# EAGLE design REDOUBLER (EAGLE 7.2.0)
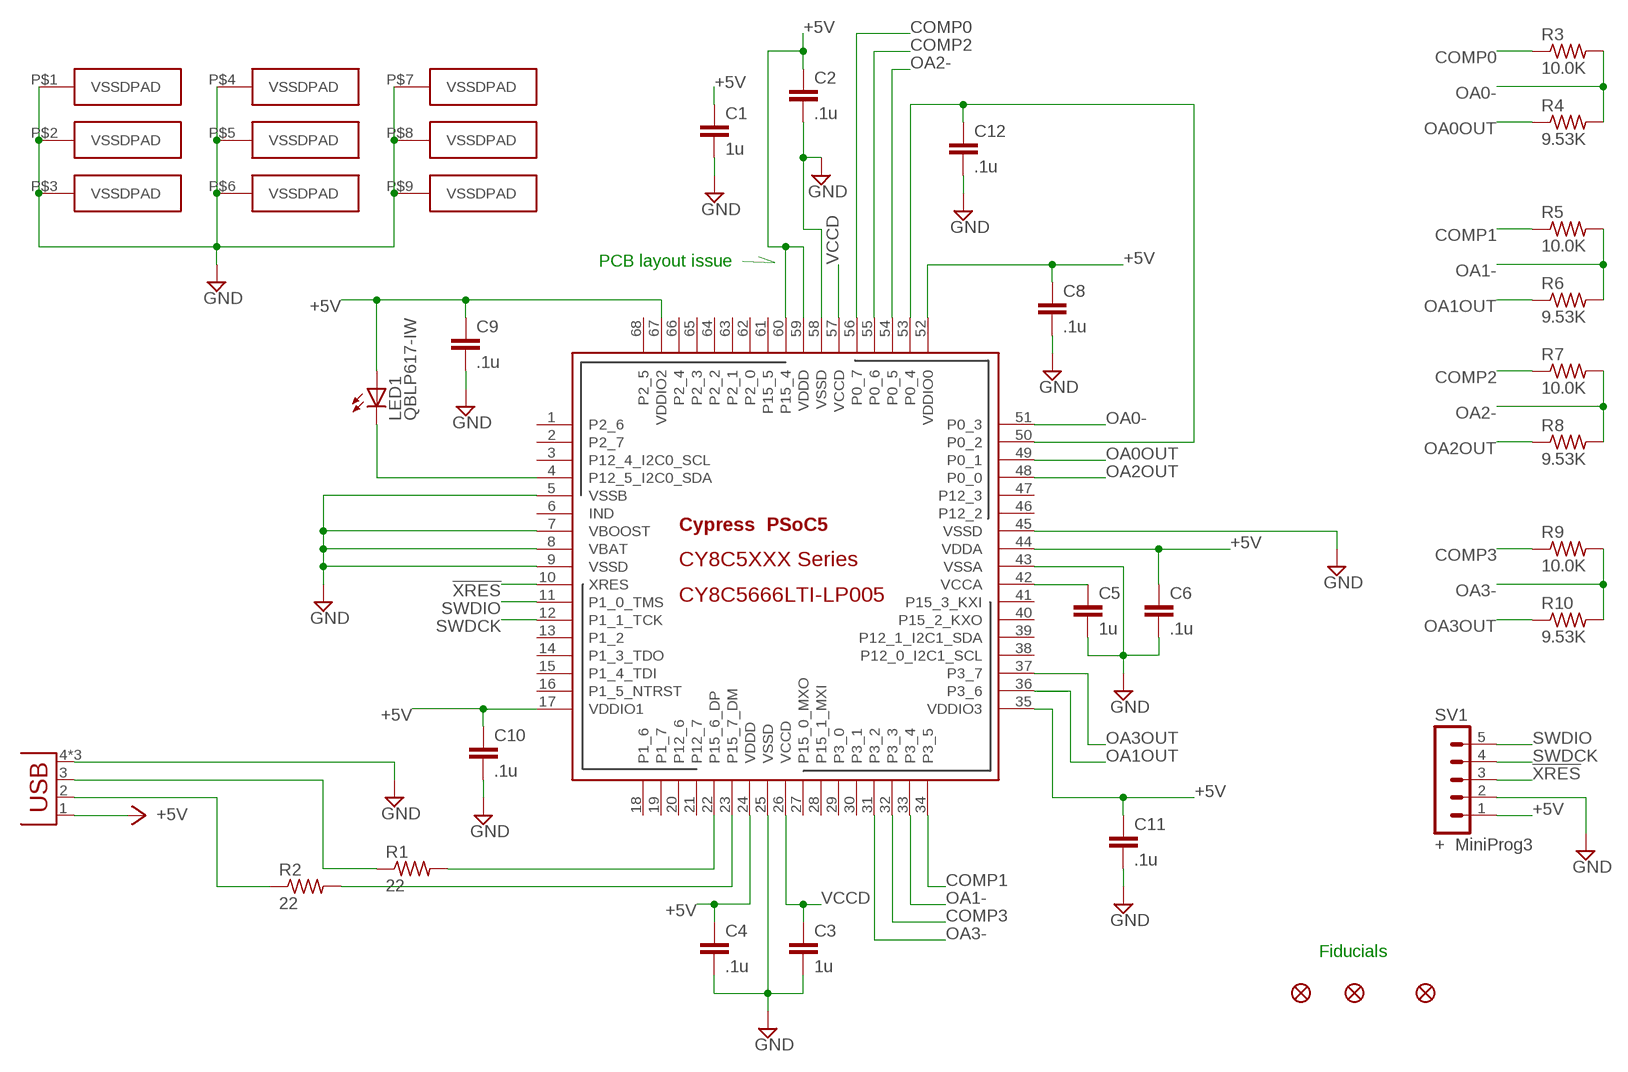
[diagram p0: schematic, sheet 1]

## Parts
C1  1u  C-EUC0402  [C0402]
C2  .1u  C-EUC0402  [C0402]
C3  1u  C-EUC0402  [C0402]
C4  .1u  C-EUC0402  [C0402]
C5  1u  C-EUC0402  [C0402]
C6  .1u  C-EUC0402  [C0402]
C8  .1u  C-EUC0402  [C0402]
C9  .1u  C-EUC0402  [C0402]
C10  .1u  C-EUC0402  [C0402]
C11  .1u  C-EUC0402  [C0402]
C12  .1u  C-EUC0402  [C0402]
FID1  FIDUCIALUFIDUCIAL  [MICRO-FIDUCIAL]
FID2  FIDUCIALUFIDUCIAL  [MICRO-FIDUCIAL]
FID3  FIDUCIALUFIDUCIAL  [MICRO-FIDUCIAL]
LED1  QBLP617-IW  LEDCHIP-LED0603  [CHIP-LED0603]
R1  22  R-US_R0402  [R0402]
R2  22  R-US_R0402  [R0402]
R3  10.0K  R-US_R0402  [R0402]
R4  9.53K  R-US_R0402  [R0402]
R5  10.0K  R-US_R0402  [R0402]
R6  9.53K  R-US_R0402  [R0402]
R7  10.0K  R-US_R0402  [R0402]
R8  9.53K  R-US_R0402  [R0402]
R9  10.0K  R-US_R0402  [R0402]
R10  9.53K  R-US_R0402  [R0402]
SV1  + MiniProg3  MA05-1  [MA05-1]
U$1  CY8C5666LTI-LP005  CY8C5XXX-68PIN  [QFN68]
X1  USBSMT-MALE  [USB-A-SMT-MALE]

## Nets
!XRES!: SV1.3 U$1.10(XRES)
+5V: C1.1 C2.1 C4.1 C6.1 C8.1 C9.1 C10.1 C11.1 LED1.A SV1.1 U$1.17(VDDIO1) U$1.24(VDDD) U$1.35(VDDIO3) U$1.44(VDDA) U$1.52(VDDIO0) U$1.59(VDDD) U$1.60(P15_4) U$1.67(VDDIO2) X1.1(VCC)
COMP0: R3.1 U$1.56(P0_7)
COMP1: R5.1 U$1.34(P3_5)
COMP2: R7.1 U$1.55(P0_6)
COMP3: R9.1 U$1.32(P3_3)
GND: C1.2 C2.2 C3.2 C4.2 C5.2 C6.2 C8.2 C9.2 C10.2 C11.2 C12.2 SV1.2 U$1.5(VSSB) U$1.7(VBOOST) U$1.8(VBAT) U$1.9(VSSD) U$1.25(VSSD) U$1.43(VSSA) U$1.45(VSSD) U$1.58(VSSD) U$1.P$1(VSSDPAD) U$1.P$2(VSSDPAD) U$1.P$3(VSSDPAD) U$1.P$4(VSSDPAD) U$1.P$5(VSSDPAD) U$1.P$6(VSSDPAD) U$1.P$7(VSSDPAD) U$1.P$8(VSSDPAD) U$1.P$9(VSSDPAD) X1.4(GND) X1.P$1(GND) X1.P$3(GND)
N$1: C12.1 U$1.50(P0_2) U$1.53(P0_4)
N$3: LED1.C U$1.4(P12_5_I2C0_SDA)
N$5: R1.1 X1.3(D+)
N$6: R2.1 X1.2(D-)
N$7: R1.2 U$1.22(P15_6_DP)
N$8: R2.2 U$1.23(P15_7_DM)
N$10: C5.1 U$1.42(VCCA)
OA0-: R3.2 R4.2 U$1.51(P0_3)
OA0OUT: R4.1 U$1.49(P0_1)
OA1-: R5.2 R6.2 U$1.33(P3_4)
OA1OUT: R6.1 U$1.36(P3_6)
OA2-: R7.2 R8.2 U$1.54(P0_5)
OA2OUT: R8.1 U$1.48(P0_0)
OA3-: R9.2 R10.2 U$1.31(P3_2)
OA3OUT: R10.1 U$1.37(P3_7)
SWDCK: SV1.4 U$1.12(P1_1_TCK)
SWDIO: SV1.5 U$1.11(P1_0_TMS)
VCCD: C3.1 U$1.26(VCCD) U$1.57(VCCD)
Unconnected: U$1.1(P2_6) U$1.2(P2_7) U$1.3(P12_4_I2C0_SCL) U$1.6(IND) U$1.13(P1_2) U$1.14(P1_3_TDO) U$1.15(P1_4_TDI) U$1.16(P1_5_NTRST) U$1.18(P1_6) U$1.19(P1_7) U$1.20(P12_6) U$1.21(P12_7) U$1.27(P15_0_MXO) U$1.28(P15_1_MXI) U$1.29(P3_0) U$1.30(P3_1) U$1.38(P12_0_I2C1_SCL) U$1.39(P12_1_I2C1_SDA) U$1.40(P15_2_KXO) U$1.41(P15_3_KXI) U$1.46(P12_2) U$1.47(P12_3) U$1.61(P15_5) U$1.62(P2_0) U$1.63(P2_1) U$1.64(P2_2) U$1.65(P2_3) U$1.66(P2_4) U$1.68(P2_5)

## Notes on the sheet
- PCB layout issue
- Fiducials

## Library data of the parts
C1-C6 C8-C12 = rcl:C-EU: CAPACITOR, European symbol
FID1-FID3 = SparkFun-Aesthetics:FIDUCIAL: Fiducial Alignment Points Various fiducial points for machine vision alignment.
LED1 = adafruit:LED: LED OSRAM: - CHIPLED LG R971, LG N971, LY N971, LG Q971, LY Q971, LO R971, LY R971 LH N974, LH R974 LS Q976, LO Q976, LY Q976 LO Q996 - Hyper CHIPLED LW Q18S LB Q993, LB Q99A, LB R99A - SideLED LS A670, LO A670, LY A670, LG A670, LP A670 LB A673, LV A673, LT A673, LW A673 LH A674 LY A675 LS A676, LA A676, LO A676, LY A676, LW A676 LS A679, LY A679, LG A679 - Hyper Micro SIDELED® LS Y876, LA Y876, LO Y876, LY Y876 LT Y87S - SmartLED LW L88C, LW L88S LB L89C, LB L89S, LG L890 LS L89K, LO L89K, LY L89K LS L896, LA L896, LO L896, LY L896 - TOPLED LS T670, LO T670, LY T670, LG T670, LP T670 LSG T670, LSP T670, LSY T670, LOP T670, LYG T670 LG T671, LOG T671, LSG T671 LB T673, LV T673, LT T673, LW T673 LH T674 LS T676, LA T676, LO T676, LY T676, LB T676, LH T676, LSB T676, LW T676 LB T67C, LV T67C, LT T67C, LS T67K, LO T67K, LY T67K, LW E67C LS E67B, LA E67B, LO E67B, LY E67B, LB E67C, LV E67C, LT E67C LW T67C LS T679, LY T679, LG T679 LS T770, LO T770, LY T770, LG T770, LP T770 LB T773, LV T773, LT T773, LW T773 LH T774 LS E675, LA E675, LY E675, LS T675 LS T776, LA T776, LO T776, LY T776, LB T776 LHGB T686 LT T68C, LB T68C - Hyper Mini TOPLED® LB M676 - Mini TOPLED Santana® LG M470 LS M47K, LO M47K, LY M47K Source: http://www.osram.convergy.de/
R1-R10 = adafruit:R-US_: RESISTOR, American symbol
SV1 = con-lstb:MA05-1: PIN HEADER; OC_FARNELL: unknown; OC_NEWARK: unknown
U$1 = PatternAgents-Cypress:CY8C5XXX-68PIN: Cypress PSoC® 5 - Programmable System on Chip, ARM Cortex-M3 Based Source Data: http://www.cypress.com/?mpn=CY8C5868LTI-LP038 PKG Source: http://www.cypress.com/?docID=38892 LBR Source: http://www.patternagents.com THIS SOFTWARE IS PROVIDED BY THE CONTRIBUTORS "AS IS" AND WITHOUT ANY EXPRESS OR IMPLIED WARRANTIES, INCLUDING, BUT NOT LIMITED TO, THE IMPLIED WARRANTIES OF MERCHANTABILITY AND FITNESS FOR A PARTICULAR PURPOSE ARE DISCLAIMED. IN NO EVENT SHALL THE COPYRIGHT OWNER OR CONTRIBUTORS BE LIABLE FOR ANY DIRECT, INDIRECT, INCIDENTAL, SPECIAL, EXEMPLARY, OR CONSEQUENTIAL DAMAGES (INCLUDING, BUT NOT LIMITED TO, PROCUREMENT OF SUBSTITUTE GOODS OR SERVICES; LOSS OF USE, DATA, OR PROFITS; OR BUSINESS INTERRUPTION) HOWEVER CAUSED AND ON ANY THEORY OF LIABILITY, WHETHER IN CONTRACT, STRICT LIABILITY, OR TORT (INCLUDING NEGLIGENCE OR OTHERWISE) ARISING IN ANY WAY OUT OF THE USE OF THIS SOFTWARE, EVEN IF ADVISED OF THE POSSIBILITY OF SUCH DAMAGE.
X1 = infnoise:USB: USB Connectors

## Board
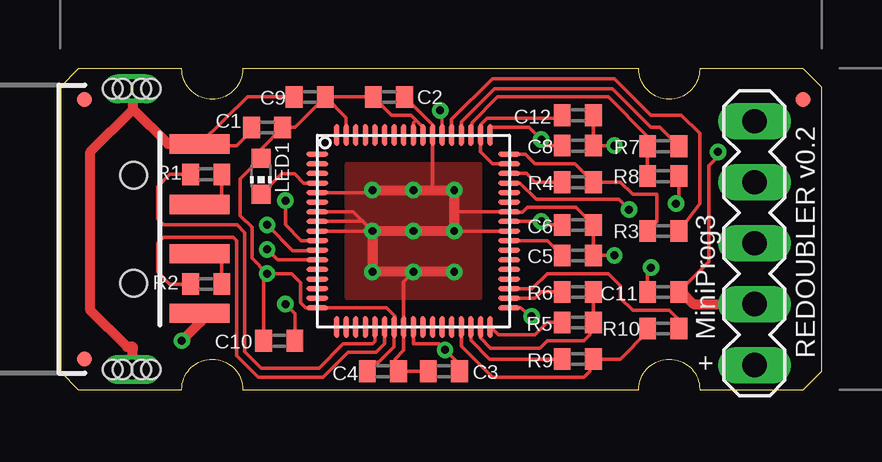
[diagram p1: board, top side]
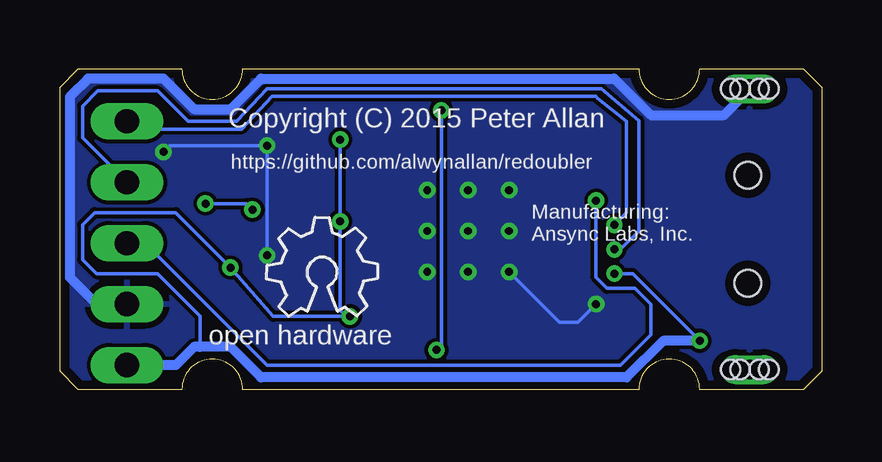
[diagram p2: board, bottom side, seen from below]

Size 31.75 x 13.36 mm. Coordinates in mm from the lower left corner, seen from the top.
Outline: 31.75,0.76 31.75,12.6 30.99,13.36 26.67,13.36 arc-90 25.4,12.09 arc-90 24.13,13.36 7.62,13.36 arc-90 6.35,12.09 arc-90 5.08,13.36 0.76,13.36 0,12.6 0,0.76 0.76,0 5.08,0 arc-90 6.35,1.27 arc-90 7.62,0 24.13,0 arc-90 25.4,1.27 arc-90 26.67,0 30.99,0 31.75,0.76
Copper layers (1*16): Top 0.0356mm / dielectric 1.5011mm / Bottom 0.0356mm
Design rules "LaenPCBOrder *": minimum track width 6mil, minimum drill 13mil, track to track 6mil, track to pad 6mil, pad to pad 6mil, via to via 6mil, smd to smd 6mil, copper to edge 15mil, drill to drill 6mil, minimum pad ring 7mil, minimum via ring 7mil, stop-mask expansion 3mil, vias tented up to drill 13mil, thermal gap 10mil
tKeepout: area 29.7,0 to 31.8,2; area 29.7,11.3 to 31.8,13.4; area 23.7,-1.7 to 27.1,1.7; area 4.6,-1.7 to 8.1,1.7; area 4.6,11.6 to 8.1,15.1; area 23.7,11.6 to 27.1,15.1

### Footprints (pad centres in the part's own frame; a part is rotated, then mirrored left to right if it is on the bottom)
C0402 = smd 0.7 x 0.9: 1 -0.65,0; 2 0.65,0
MICRO-FIDUCIAL = smd 0.635 x 0.635: 1 0,0
CHIP-LED0603 = smd 0.8 x 0.8: A 0,-0.75; C 0,0.75
R0402 = smd 0.7 x 0.9: 1 -0.65,0; 2 0.65,0
MA05-1 = drill 1.016 long: 1 -5.08,0; 2 -2.54,0; 3 0,0; 4 2.54,0; 5 5.08,0
QFN68 = smd 0.9 x 0.2: 1 -4,3.2; 2 -4,2.8; 3 -4,2.4; 4 -4,2; 5 -4,1.6; 6 -4,1.2; 7 -4,0.8; 8 -4,0.4; 9 -4,0; 10 -4,-0.4; 11 -4,-0.8; 12 -4,-1.2; 13 -4,-1.6; 14 -4,-2; 15 -4,-2.4; 16 -4,-2.8; 17 -4,-3.2; 35 4,-3.2; 36 4,-2.8; 37 4,-2.4; 38 4,-2; 39 4,-1.6; 40 4,-1.2; 41 4,-0.8; 42 4,-0.4; 43 4,0; 44 4,0.4; 45 4,0.8; 46 4,1.2; 47 4,1.6; 48 4,2; 49 4,2.4; 50 4,2.8; 51 4,3.2 | smd 0.2 x 0.9: 18 -3.2,-4; 19 -2.8,-4; 20 -2.4,-4; 21 -2,-4; 22 -1.6,-4; 23 -1.2,-4; 24 -0.8,-4; 25 -0.4,-4; 26 0,-4; 27 0.4,-4; 28 0.8,-4; 29 1.2,-4; 30 1.6,-4; 31 2,-4; 32 2.4,-4; 33 2.8,-4; 34 3.2,-4; 52 3.2,4; 53 2.8,4; 54 2.4,4; 55 2,4; 56 1.6,4; 57 1.2,4; 58 0.8,4; 59 0.4,4; 60 0,4; 61 -0.4,4; 62 -0.8,4; 63 -1.2,4; 64 -1.6,4; 65 -2,4; 66 -2.4,4; 67 -2.8,4; 68 -3.2,4 | drill 0.33: P$1 -1.705,-1.705; P$2 0,-1.705; P$3 1.705,-1.705; P$4 1.705,0; P$5 0,0; P$6 -1.705,0; P$7 -1.705,1.705; P$8 0,1.705; P$9 1.705,1.705
USB-A-SMT-MALE = smd 0.8 x 2.5: 1 -3.5,-5.87; 2 -1.027,-5.87; 3 1.027,-5.87; 4 3.551,-5.87 | drill 0.8 pad 0.94 long: P$1 5.85,-3.05; P$3 -5.85,-3.05 | hole 1.1: 2.25,-3.12; -2.25,-3.12 | hole 0.8: -5.85,-3.45; -5.85,-3.85; -5.85,-2.65; -5.85,-2.25; 5.85,-3.45; 5.85,-3.85; 5.85,-2.65; 5.85,-2.25

### Placement (x,y rotation side)
C1  8.64,10.92 180 top
C2  13.72,12.19 0 top
C3  16,0.76 180 top
C4  13.46,0.76 0 top
C5  21.59,5.59 0 top
C6  21.59,6.86 0 top
C8  21.59,10.16 0 top
C9  10.41,12.19 180 top
C10  9.14,2.03 0 top
C11  25.15,4.06 0 top
C12  21.59,11.43 0 top
FID1  1.02,1.27 0 top
FID2  1.02,12.09 0 top
FID3  30.99,12.09 0 top
LED1  8.38,8.89 180 top
R1  6.1,8.97 180 top
R2  6.1,4.39 180 top
R3  25.15,6.6 180 top
R4  21.59,8.64 0 top
R5  21.59,2.79 0 top
R6  21.59,4.06 0 top
R7  25.15,10.13 180 top
R8  25.15,8.89 180 top
R9  21.59,1.27 0 top
R10  25.15,2.54 180 top
SV1  28.96,6.1 90 top
U$1  14.73,6.6 0 top
X1  -0.05,6.68 90 top

### Tracks (layer width: path | path; a pad name or v marks a point on that pad's centre or on a via)
!XRES!  (via drill 0.33)
  Top 0.152: U$1.10 10.05,6.2 9.4,6.86 v9.4,7.87
  Bottom 0.152: SV1.3 28.19,6.1 23.11,1.02 8.38,1.02 7.11,2.29 7.11,3.56 7.77,4.22 8.94,4.22 9.4,4.67 v9.4,7.87
+5V  (via drill 0.33)
  Top 0.152: C4.1 13.19,1.14 13.28,1.14 13.93,1.79 U$1.24 13.97,2.64 13.97,3.05 13.61,3.4 U$1.17 10.24,3.4 10.03,3.61 10.03,4.45 9.65,4.83 v8.64,4.83 | U$1.44 v20.07,7.01 20.22,6.86 C6.1 | U$1.35 19.2,3.4 v19.66,3.05 | U$1.67 11.93,11.32 C9.1 | C9.1 C2.1 13.83,11.43 14.63,11.43 14.83,11.23 | C8.1 20.32,10.16 v20.07,10.41 19.56,10.92 18.03,10.92 17.93,10.82 U$1.52 | U$1.59 15.13,10.93 14.83,11.23 | U$1.60 14.73,11.12 14.83,11.23 | C11.1 24.5,4.94 v24.64,5.08 | C9.1 9.79,10.92 C1.1 8.38,10.02 LED1.A 7.52,8.78 7.52,7.24 8,6.76 8,5.46 v8.64,4.83 | C10.1 8.49,4.68 v8.64,4.83
  Top 0.406: X1.1 5.87,2.82 v5.08,2.03
  Bottom 0.152: 25.91,1.78 25.91,3.05 27.69,4.83 30.23,4.83 30.81,5.41 30.81,6.86 30.3,7.37 26.92,7.37 v24.64,5.08 22.86,3.05 v19.66,3.05 19.81,3.05 20.07,3.3 v20.07,7.01 v20.07,10.41 | v5.08,2.03 7.87,4.83 v8.64,4.83
  Bottom 0.406: v5.08,2.03 6.6,2.03 8.13,0.51 23.37,0.51 24.64,1.78 25.91,1.78 26.16,1.78 26.92,1.02 SV1.1
COMP0
  Top 0.152: U$1.56 16.33,11.25 18.03,12.95 23.11,12.95 24.64,11.43 25.91,11.43 26.67,10.67 26.67,7.73 R3.1
COMP1
  Top 0.152: U$1.34 17.97,2.6 18.29,2.29 19.81,2.29 20.32,2.79 R5.1
COMP2
  Top 0.152: U$1.55 16.74,10.61 16.74,11.15 18.11,12.52 23.04,12.52 24.64,10.92 25.01,10.92 R7.1
COMP3
  Top 0.152: U$1.32 17.13,2.04 17.91,1.27 R9.1
GND  (via drill 0.33)  (1 unrouted)
  Top 0.152: C3.2 C4.2 13.97,0.9 13.97,1.27 14.33,1.63 U$1.25 14.33,4.5 U$1.P$2 | 15.49,8.31 15.53,8.35 U$1.58 15.53,11.04 15.49,11.07 15.48,11.07 C2.2 | U$1.43 U$1.P$4 | 16.44,7.37 16.48,7.4 U$1.45 18.75,7.39 19.28,7.39 19.48,7.59 21.5,7.59 C6.2 C5.2 v23.11,5.59 | 25.91,4.06 C11.2 27.05,5.32 27.05,9.32 27.43,9.7 v27.43,9.91 | U$1.5 12.92,8.2 U$1.P$7 | U$1.9 U$1.P$6 | U$1.8 12.63,7 U$1.P$6 | U$1.7 12.23,7.4 U$1.P$6 | C9.2 7.83,12.19 X1.4 5.94,10.16 7.37,10.16 7.99,10.78 C1.2 | v23.11,10.16 C8.2 C12.2 | C10.2 9.79,3.16 v9.4,3.56
  Top 0.406: 3.05,11.68 3.05,12.53 X1.P$1 | X1.P$3 3.05,1.78 2.8,1.78 1.27,3.3 1.27,9.91 3.05,11.68 | U$1.P$7 U$1.P$8 15.49,8.31 U$1.P$9 16.44,7.37 U$1.P$4 U$1.P$5 U$1.P$6 U$1.P$1 U$1.P$2 U$1.P$3 | 25.91,4.06 26.42,3.56 SV1.2 | X1.4 4.5,10.23 3.05,11.68
  Bottom 0.152: v27.43,9.91 27.18,10.16 v23.11,10.16 v23.11,5.59 | U$1.P$1 10.92,2.79 10.16,2.79 v9.4,3.56
  Bottom 0.406: 3.05,12.45 4.06,11.43 7.11,11.43 8.64,12.95 23.37,12.95 24.64,11.68 26.16,11.68 27.43,12.95 30.58,12.95 31.34,12.19 31.34,4.67 30.23,3.56 SV1.2
  pour Top: 11.94,9.4 17.53,9.4 17.53,3.81 11.94,3.81
  pour Bottom: 0,13.46 31.75,13.46 31.75,0 0,0
N$1
  Top 0.152: U$1.50 18.03,9.4 17.53,9.91 U$1.53 17.56,11.05 17.8,11.3 20.81,11.3 C12.1
N$3
  Top 0.152: LED1.C 9.23,8.99 9.78,8.99 10.17,8.6 U$1.4
N$5
  Top 0.152: R1.1 6.75,8.02 6.6,7.87 6.04,7.87 X1.3
N$6
  Top 0.152: R2.1 6.75,5.45 6.6,5.59 5.93,5.59 X1.2
N$7
  Top 0.152: U$1.22 | R1.2 4.57,8.97 4.06,8.46 4.06,7.11 4.32,6.86 7.39,6.86 7.7,6.53 7.7,1.57 8.38,0.89 10.79,0.89 11.81,1.91 13.03,1.91 13.13,2.01 U$1.22
N$8
  Top 0.152: U$1.23 13.54,1.91 13.18,1.55 12.01,1.55 10.97,0.51 8.26,0.51 7.37,1.4 7.37,6.2 7.21,6.35 4.32,6.35 4.06,6.1 4.06,4.9 4.57,4.39 R2.2
N$10
  Top 0.152: U$1.42 20.32,6.2 C5.1
OA0-
  Top 0.152: U$1.51 19.41,9.8 19.81,9.4 21.48,9.4 R4.2 23.37,8.64 23.88,8.13 24.89,8.13 24.89,7 R3.2
OA0OUT
  Top 0.152: U$1.49 19.44,9 19.81,8.64 R4.1
OA1-
  Top 0.152: U$1.33 17.53,2.15 17.96,1.73 20.02,1.73 20.32,2.03 21.84,2.03 22.1,2.29 22.1,2.65 R5.2 R6.2
OA1OUT
  Top 0.152: R6.1 20.07,4.06 19.81,3.81 U$1.36
OA2-
  Top 0.152: U$1.54 17.17,10.64 17.17,11.12 18.24,12.19 22.86,12.19 24.5,10.56 R7.2 R8.2
OA2OUT  (via drill 0.33)
  Top 0.152: U$1.48 19.18,8.6 19.86,7.92 23.29,7.92 v23.72,7.49 | R8.1 25.8,7.86 v25.68,7.75
  Bottom 0.152: v25.68,7.75 23.98,7.75 v23.72,7.49
OA3-
  Top 0.152: R10.2 24.5,2.4 23.37,1.27 R9.2 22.1,1.13 22.1,0.76 21.84,0.51 18.03,0.51 16.74,1.8 U$1.31
OA3OUT
  Top 0.152: U$1.37 18.75,4.19 19.68,4.19 20.32,4.83 22.86,4.83 23.37,4.32 23.37,3.81 23.88,3.3 25.4,3.3 25.8,2.91 R10.1
SWDCK  (via drill 0.33)
  Top 0.152: U$1.12 9.07,5.41 v8.64,5.84
  Bottom 0.152: SV1.4 30.81,10.49 30.81,11.81 30.18,12.45 27.69,12.45 26.42,11.18 24.38,11.18 23.11,12.52 9.17,12.52 7.62,11.2 7.62,6.6 8.38,5.84 v8.64,5.84
SWDIO  (via drill 0.33)
  Top 0.152: U$1.11 10.72,5.79 9.7,5.79 v8.64,6.86
  Bottom 0.152: SV1.5 28.27,10.85 24.18,10.85 22.91,12.22 9.4,12.22 9.35,12.14 8.13,11.18 8.13,7.37 v8.64,6.86
VCCD  (via drill 0.33)
  Top 0.152: U$1.26 14.73,1.91 15.8,1.91 v16.05,1.65 16.65,1.05 C3.1 | U$1.57 15.93,11.58 v15.85,11.63
  Bottom 0.152: v15.85,11.63 15.85,1.85 v16.05,1.65

### Text on the board
bPlace: Copyright (C) 2015 Peter Allan | https://github.com/alwynallan/redoubler | Manufacturing: / Ansync Labs, Inc. | open hardware
tNames: REDOUBLER v0.2